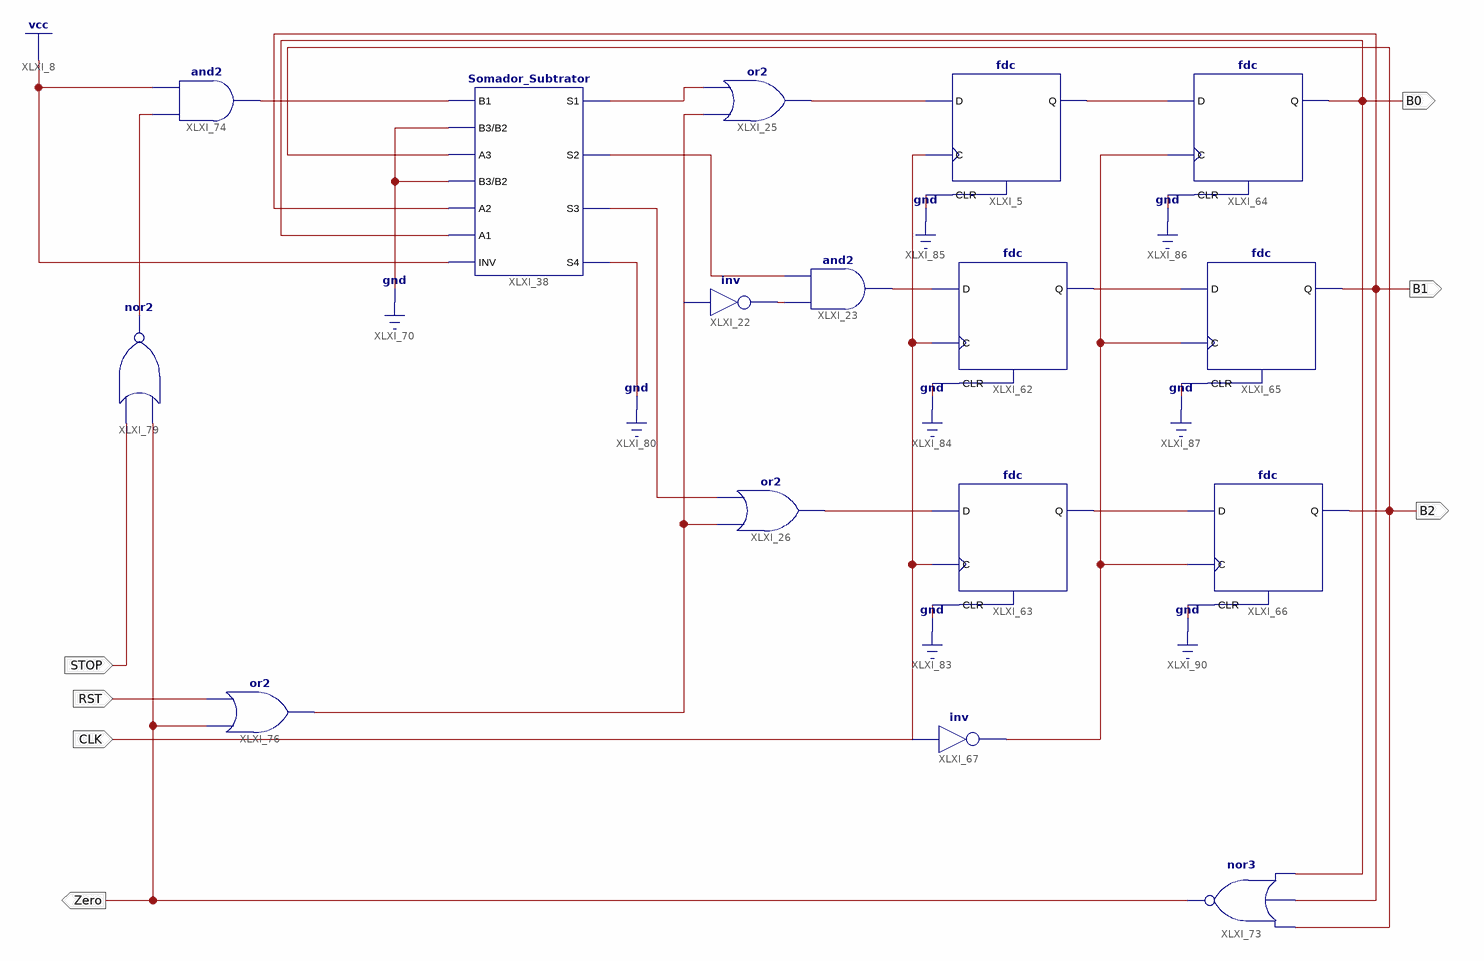
[diagram p0: schematic sheet 1]
// Xilinx ISE schematic Relogio.sch (spartan3) as structural Verilog: 16 symbols, 7 ports
module Relogio (
  input  CLK,
  input  STOP,
  input  RST,
  output B0,
  output B2,
  output Zero,
  output B1
);

  wire X, XLXN_18, XLXN_19, XLXN_20, XLXN_21, XLXN_24, XLXN_25, XLXN_26, XLXN_94, XLXN_95, XLXN_96, XLXN_99,
       XLXN_104, XLXN_116;

  and XLXI_23 (XLXN_25, XLXN_26, XLXN_24);
  or XLXI_26 (XLXN_21, X, XLXN_20);
  or XLXI_25 (XLXN_19, X, XLXN_18);
  not XLXI_22 (XLXN_26, X);
  fdc XLXI_5 (.C(CLK), .CLR(1'b0), .D(XLXN_19), .Q(XLXN_94));
  fdc XLXI_62 (.C(CLK), .CLR(1'b0), .D(XLXN_25), .Q(XLXN_96));
  fdc XLXI_63 (.C(CLK), .CLR(1'b0), .D(XLXN_21), .Q(XLXN_95));
  fdc XLXI_64 (.C(XLXN_99), .CLR(1'b0), .D(XLXN_94), .Q(B0));
  fdc XLXI_65 (.C(XLXN_99), .CLR(1'b0), .D(XLXN_96), .Q(B1));
  fdc XLXI_66 (.C(XLXN_99), .CLR(1'b0), .D(XLXN_95), .Q(B2));
  not XLXI_67 (XLXN_99, CLK);
  Somador_Subtrator XLXI_38 (
    .B1(XLXN_116), .B3(1'b0), .A3(B2), .B2(1'b0), .A2(B1), .A1(B0), .INV(1'b1), .S1(XLXN_18), .S2(XLXN_24),
    .S3(XLXN_20), .S4(1'b0));
  nor XLXI_73 (Zero, B0, B1, B2);
  and XLXI_74 (XLXN_116, XLXN_104, 1'b1);
  or XLXI_76 (X, Zero, RST);
  nor XLXI_79 (XLXN_104, Zero, STOP);
endmodule
